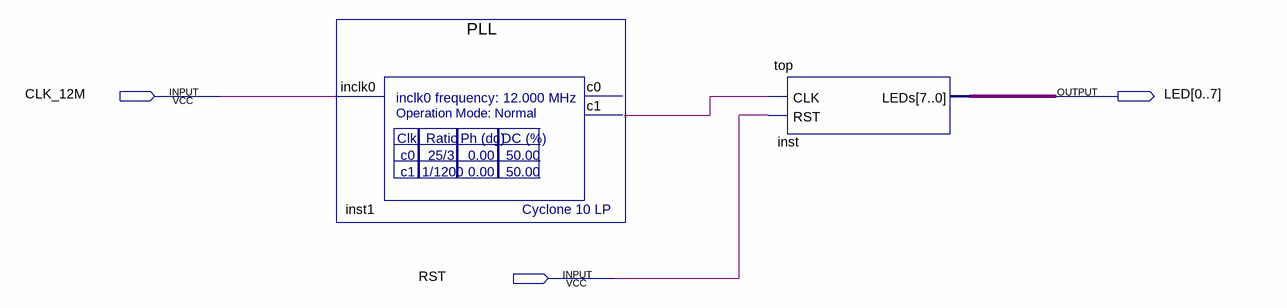
[diagram p0: schematic sheet]
// Quartus schematic test1.bdf as structural Verilog: 2 symbols, 3 pins
module test1 (
  input  CLK_12M,
  input  RST,
  output [0:7] LED
);

  wire inst1_c1;

  PLL inst1 (.inclk0(CLK_12M), .c1(inst1_c1));  // open: c0
  top inst (.CLK(inst1_c1), .RST(RST), .LEDs(LED));
endmodule
